# EAGLE design PIN2DMD_Nucleo144 (EAGLE 7.4.0)
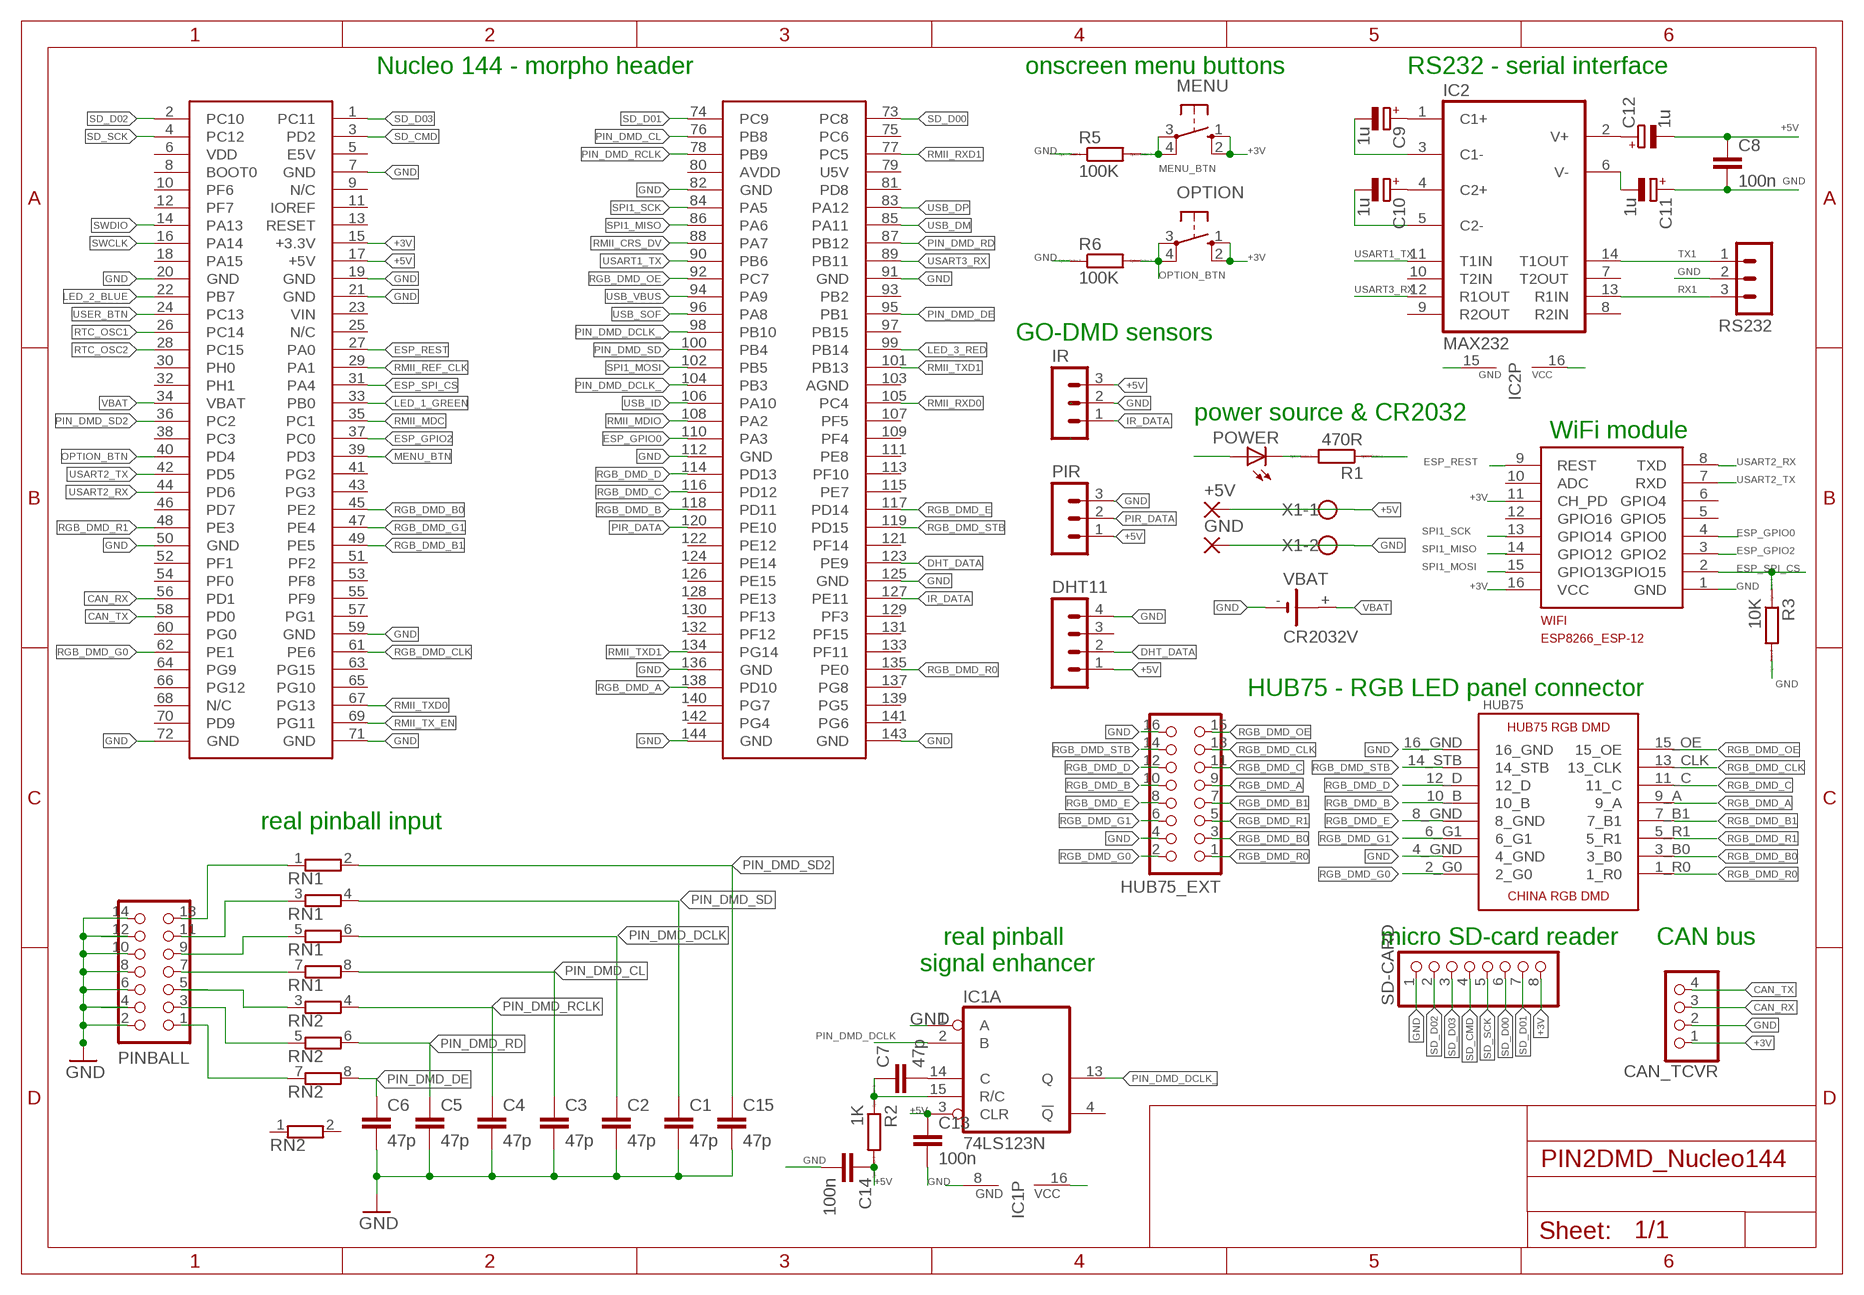
[diagram p0: schematic, sheet 1]

## Parts
+5V  WIREPADSMD2,54-5,08  [SMD2,54-5,08]
C1  47p  C-EU025-024X044  [C025-024X044]
C2  47p  C-EU025-024X044  [C025-024X044]
C3  47p  C-EU025-024X044  [C025-024X044]
C4  47p  C-EU025-024X044  [C025-024X044]
C5  47p  C-EU025-024X044  [C025-024X044]
C6  47p  C-EU025-024X044  [C025-024X044]
C7  47p  C-EU025-024X044  [C025-024X044]
C8  100n  C-EU025-024X044  [C025-024X044]
C9  1u  CPOL-EUE2-4  [E2-4]
C10  1u  CPOL-EUE2-4  [E2-4]
C11  1u  CPOL-EUE2-4  [E2-4]
C12  1u  CPOL-EUE2-4  [E2-4]
C13  100n  C-EU025-024X044  [C025-024X044]
C14  100n  C-EU025-024X044  [C025-024X044]
C15  47p  C-EU025-024X044  [C025-024X044]
CAN_TCVR  PINHD-1X4  [1X04]
DHT11  MA04-1  [MA04-1]
GND  WIREPADSMD2,54-5,08  [SMD2,54-5,08]
HUB75  RGB_DMD_HUB75_HEADER_FEMALE  [16_PIN_HUB75_RGB_FEMALE_DOWN]
HUB75_EXT  CON_HEADER_2X08B  [PINSHRD_PTH_2X08]
IC1  74LS123N  [DIL16]
IC2  MAX232  [DIL16]
IR  MA03-1  [MA03-1]
MENU  10-XX  [B3F-10XX]
OPTION  10-XX  [B3F-10XX]
PINBALL  CON_HEADER_2X07-PTH-SHROUDED  [PINSHRD_PTH_2X07]
PIR  MA03-1  [MA03-1]
POWER  LED3MM  [LED3MM]
R1  470R  R0207/10  [0207/10]
R2  1K  R0207/10  [0207/10]
R3  10K  R0207/10  [0207/10]
R5  100K  R0207/10  [0207/10]
R6  100K  R0207/10  [0207/10]
RN1  E4RP  [SIL8]
RN2  E4RP  [SIL8]
RS232  MA03-1  [MA03-1]
SD-CARD  PINHD-1X8  [1X08]
U$1  NUCLEO-144  [NUCLEO-144]
VBAT  CR2032V  [CR2032V]
WIFI  ESP8266_ESP-12  [ESP8266-ESP12]
X1  W237-102  [W237-102]

## Nets
+3V: CAN_TCVR.1 MENU.1(S) MENU.2(S1) OPTION.1(S) OPTION.2(S1) SD-CARD.8 U$1.15(+3.3V) WIFI.11(CH_PD) WIFI.16(VCC)
+5V: +5V.1(P) C8.1 C12.- C13.1 C14.1 DHT11.1 IC1.3(A:CLR) IC1.16(P:VCC) IC2.16(VCC) IR.3 PIR.1 POWER.A R2.2 U$1.17(+5V) X1.1
CAN_RX: CAN_TCVR.3 U$1.56(PD1)
CAN_TX: CAN_TCVR.4 U$1.58(PD0)
DHT_DATA: DHT11.2 U$1.123(PE9)
ESP_GPIO0: U$1.110(PA3) WIFI.4(GPIO0)
ESP_GPIO2: U$1.37(PC0) WIFI.3(GPIO2)
ESP_REST: U$1.27(PA0) WIFI.9(REST)
ESP_SPI_CS: R3.1 U$1.31(PA4) WIFI.2(GPIO15)
GND: C1.2 C2.2 C3.2 C4.2 C5.2 C6.2 C8.2 C11.+ C13.2 C14.2 C15.2 CAN_TCVR.2 DHT11.4 GND.1(P) HUB75.4_GND HUB75.16_GND HUB75_EXT.4 HUB75_EXT.16 IC1.1(A:A) IC1.8(P:GND) IC2.15(GND) IR.2 PINBALL.2 PINBALL.4 PINBALL.6 PINBALL.8 PINBALL.10 PINBALL.12 PINBALL.14 PIR.3 R1.1 R3.2 R5.1 R6.1 RS232.2 SD-CARD.1 U$1.7(GND) U$1.19(GND) U$1.20(GND) U$1.21(GND) U$1.50(GND) U$1.59(GND) U$1.71(GND) U$1.72(GND) U$1.82(GND) U$1.91(GND) U$1.112(GND) U$1.125(GND) U$1.136(GND) U$1.143(GND) U$1.144(GND) VBAT.- WIFI.1(GND) X1.2
IR_DATA: IR.1 U$1.127(PE11)
LED_1_GREEN: U$1.33(PB0)
LED_2_BLUE: U$1.22(PB7)
LED_3_RED: U$1.99(PB14)
MENU_BTN: MENU.3(P) MENU.4(P1) R5.2 U$1.39(PD3)
N$1: POWER.K(C) R1.2
N$2: C7.1 IC1.15(A:R/C) R2.1
N$3: C7.2 IC1.14(A:C)
N$4: C9.+ IC2.1(C1+)
N$5: PINBALL.7 RN1.7
N$6: PINBALL.5 RN2.3
N$7: C10.+ IC2.4(C2+)
N$8: C11.- IC2.6(V-)
N$9: C9.- IC2.3(C1-)
N$10: C10.- IC2.5(C2-)
N$11: PINBALL.3 RN2.5
N$12: PINBALL.1 RN2.7
N$13: PINBALL.9 RN1.5
N$14: PINBALL.11 RN1.3
N$16: C12.+ IC2.2(V+)
N$18: PINBALL.13 RN1.1
OPTION_BTN: OPTION.3(P) OPTION.4(P1) R6.2 U$1.40(PD4)
PIN_DMD_CL: C3.1 RN1.8 U$1.76(PB8)
PIN_DMD_DCLK: C2.1 IC1.2(A:B) RN1.6
PIN_DMD_DCLK_: IC1.13(A:Q) U$1.98(PB10) U$1.104(PB3)
PIN_DMD_DE: C6.1 RN2.8 U$1.95(PB1)
PIN_DMD_RCLK: C4.1 RN2.4 U$1.78(PB9)
PIN_DMD_RD: C5.1 RN2.6 U$1.87(PB12)
PIN_DMD_SD: C1.1 RN1.4 U$1.100(PB4)
PIN_DMD_SD2: C15.1 RN1.2 U$1.36(PC2)
PIR_DATA: PIR.2 U$1.120(PE10)
RGB_DMD_A: HUB75.9_A HUB75_EXT.9 U$1.138(PD10)
RGB_DMD_B: HUB75.10_B HUB75_EXT.10 U$1.118(PD11)
RGB_DMD_B0: HUB75.3_B0 HUB75_EXT.3 U$1.45(PE2)
RGB_DMD_B1: HUB75.7_B1 HUB75_EXT.7 U$1.49(PE5)
RGB_DMD_C: HUB75.11_C HUB75_EXT.11 U$1.116(PD12)
RGB_DMD_CLK: HUB75.13_CLK HUB75_EXT.13 U$1.61(PE6)
RGB_DMD_D: HUB75.12_D HUB75_EXT.12 U$1.114(PD13)
RGB_DMD_E: HUB75.8_GND HUB75_EXT.8 U$1.117(PD14)
RGB_DMD_G0: HUB75.2_G0 HUB75_EXT.2 U$1.62(PE1)
RGB_DMD_G1: HUB75.6_G1 HUB75_EXT.6 U$1.47(PE4)
RGB_DMD_OE: HUB75.15_OE HUB75_EXT.15 U$1.92(PC7)
RGB_DMD_R0: HUB75.1_R0 HUB75_EXT.1 U$1.135(PE0)
RGB_DMD_R1: HUB75.5_R1 HUB75_EXT.5 U$1.48(PE3)
RGB_DMD_STB: HUB75.14_STB HUB75_EXT.14 U$1.119(PD15)
RMII_CRS_DV: U$1.88(PA7)
RMII_MDC: U$1.35(PC1)
RMII_MDIO: U$1.108(PA2)
RMII_REF_CLK: U$1.29(PA1)
RMII_RXD0: U$1.105(PC4)
RMII_RXD1: U$1.77(PC5)
RMII_TX_EN: U$1.69(PG11)
RMII_TXD0: U$1.67(PG13)
RMII_TXD1: U$1.101(PB13) U$1.134(PG14)
RTC_OSC1: U$1.26(PC14)
RTC_OSC2: U$1.28(PC15)
RX1: IC2.13(R1IN) RS232.3
SD_CMD: SD-CARD.4 U$1.3(PD2)
SD_D00: SD-CARD.6 U$1.73(PC8)
SD_D01: SD-CARD.7 U$1.74(PC9)
SD_D02: SD-CARD.2 U$1.2(PC10)
SD_D03: SD-CARD.3 U$1.1(PC11)
SD_SCK: SD-CARD.5 U$1.4(PC12)
SPI1_MISO: U$1.86(PA6) WIFI.14(GPIO12)
SPI1_MOSI: U$1.102(PB5) WIFI.15(GPIO13)
SPI1_SCK: U$1.84(PA5) WIFI.13(GPIO14)
SWCLK: U$1.16(PA14)
SWDIO: U$1.14(PA13)
TX1: IC2.14(T1OUT) RS232.1
USART1_TX: IC2.11(T1IN) U$1.90(PB6)
USART2_RX: U$1.44(PD6) WIFI.8(TXD)
USART2_TX: U$1.42(PD5) WIFI.7(RXD)
USART3_RX: IC2.12(R1OUT) U$1.89(PB11)
USB_DM: U$1.85(PA11)
USB_DP: U$1.83(PA12)
USB_ID: U$1.106(PA10)
USB_SOF: U$1.96(PA8)
USB_VBUS: U$1.94(PA9)
USER_BTN: U$1.24(PC13)
VBAT: U$1.34(VBAT) VBAT.+
Unconnected: DHT11.3 IC1.4(A:!Q) IC1.5(B:Q) IC1.6(B:C) IC1.7(B:R/C) IC1.9(B:A) IC1.10(B:B) IC1.11(B:CLR) IC1.12(B:!Q) IC2.7(T2OUT) IC2.8(R2IN) IC2.9(R2OUT) IC2.10(T2IN) RN2.1 RN2.2 U$1.5(E5V) U$1.6(VDD) U$1.8(BOOT0) U$1.9(N/C) U$1.10(PF6) U$1.11(IOREF) U$1.12(PF7) U$1.13(RESET) U$1.18(PA15) U$1.23(VIN) U$1.25(N/C) U$1.30(PH0) U$1.32(PH1) U$1.38(PC3) U$1.41(PG2) U$1.43(PG3) U$1.46(PD7) U$1.51(PF2) U$1.52(PF1) U$1.53(PF8) U$1.54(PF0) U$1.55(PF9) U$1.57(PG1) U$1.60(PG0) U$1.63(PG15) U$1.64(PG9) U$1.65(PG10) U$1.66(PG12) U$1.68(N/C) U$1.70(PD9) U$1.75(PC6) U$1.79(U5V) U$1.80(AVDD) U$1.81(PD8) U$1.93(PB2) U$1.97(PB15) U$1.103(AGND) U$1.107(PF5) U$1.109(PF4) U$1.111(PE8) U$1.113(PF10) U$1.115(PE7) U$1.121(PF14) U$1.122(PE12) U$1.124(PE14) U$1.126(PE15) U$1.128(PE13) U$1.129(PF3) U$1.130(PF13) U$1.131(PF15) U$1.132(PF12) U$1.133(PF11) U$1.137(PG8) U$1.139(PG5) U$1.140(PG7) U$1.141(PG6) U$1.142(PG4) VBAT.+@1(+) WIFI.5(GPIO5) WIFI.6(GPIO4) WIFI.10(ADC) WIFI.12(GPIO16)

## Notes on the sheet
- Nucleo 144 - morpho header | onscreen menu buttons | RS232 - serial interface
- GO-DMD sensors
- power source & CR2032
- WiFi module
- HUB75 - RGB LED panel connector
- real pinball input
- micro SD-card reader | CAN bus
- real pinball 
  signal enhancer

## Library data of the parts
+5V GND = wirepad:WIREPAD: Wire PAD connect wire on PCB
C1-C8 C13-C15 = resistor:C-EU: CAPACITOR, European symbol
C9-C12 = resistor:CPOL-EU: POLARIZED CAPACITOR, European symbol
CAN_TCVR = pinhead:PINHD-1X4: PIN HEADER
DHT11 = con-lstb:MA04-1: PIN HEADER; OC_FARNELL: unknown; OC_NEWARK: unknown
HUB75 = zzz_Sascha:RGB_DMD_HUB75_HEADER: RGB DMD Header HUB75 Created 21.10.2015 by DIY Sascha Header zum Anschluss eines CHINA RGB DMD mit 16 Pins Port = HUB75!!! Pin: Function: Desciption: 1 R0 Red data (columns 1-16) 2 G0 Green data (columns 1-16) 3 B0 Blue data (columns 1-16) 4 GND Ground 5 R1 Red data (columns 17-32) 6 G1 Green data (columns 17-32) 7 B1 Blue data (columns 17-32) 8 GND Ground 9 A Demux input A0 10 B Demux input A1 11 C Demux input A2 12 D Demux input E1, E3 (32x32 panels only) 13 CLK LED drivers' clock 14 STB LED drivers' latch 15 OE LED drivers' output enable 16 GND Ground ENJOY!
HUB75_EXT = dp_devices.v6:CON_HEADER_2X08
IC1 = 74xx-eu:74*123: Retriggerable monostable MULTIVIBRATOR
IC2 = maxim:MAX232: RS232 TRANSCEIVER; MF: MAXIM; MPN: MAX232ACPE+; OC_FARNELL: 9723773; OC_NEWARK: 68K4544
IR PIR RS232 = con-lstb:MA03-1: PIN HEADER; OC_FARNELL: unknown; OC_NEWARK: unknown
MENU OPTION = switch-omron:10-XX: OMRON SWITCH; MPN: B3F-1000; OC_FARNELL: 176432; OC_NEWARK: 36M3542
PINBALL = dp_devices.v6:CON_HEADER_2X07: 2x07 pin header
POWER = led:LED: LED OSRAM: - CHIPLED LG R971, LG N971, LY N971, LG Q971, LY Q971, LO R971, LY R971 LH N974, LH R974 LS Q976, LO Q976, LY Q976 LO Q996 - Hyper CHIPLED LW Q18S LB Q993, LB Q99A, LB R99A - SideLED LS A670, LO A670, LY A670, LG A670, LP A670 LB A673, LV A673, LT A673, LW A673 LH A674 LY A675 LS A676, LA A676, LO A676, LY A676, LW A676 LS A679, LY A679, LG A679 - Hyper Micro SIDELED® LS Y876, LA Y876, LO Y876, LY Y876 LT Y87S - SmartLED LW L88C, LW L88S LB L89C, LB L89S, LG L890 LS L89K, LO L89K, LY L89K LS L896, LA L896, LO L896, LY L896 - TOPLED LS T670, LO T670, LY T670, LG T670, LP T670 LSG T670, LSP T670, LSY T670, LOP T670, LYG T670 LG T671, LOG T671, LSG T671 LB T673, LV T673, LT T673, LW T673 LH T674 LS T676, LA T676, LO T676, LY T676, LB T676, LH T676, LSB T676, LW T676 LB T67C, LV T67C, LT T67C, LS T67K, LO T67K, LY T67K, LW E67C LS E67B, LA E67B, LO E67B, LY E67B, LB E67C, LV E67C, LT E67C LW T67C LS T679, LY T679, LG T679 LS T770, LO T770, LY T770, LG T770, LP T770 LB T773, LV T773, LT T773, LW T773 LH T774 LS E675, LA E675, LY E675, LS T675 LS T776, LA T776, LO T776, LY T776, LB T776 LHGB T686 LT T68C, LB T68C - Hyper Mini TOPLED® LB M676 - Mini TOPLED Santana® LG M470 LS M47K, LO M47K, LY M47K Source: http://www.osram.convergy.de LUXEON: - LUMILED® LXK2-PW12-R00, LXK2-PW12-S00, LXK2-PW14-U00, LXK2-PW14-V00 LXK2-PM12-R00, LXK2-PM12-S00, LXK2-PM14-U00 LXK2-PE12-Q00, LXK2-PE12-R00, LXK2-PE12-S00, LXK2-PE14-T00, LXK2-PE14-U00 LXK2-PB12-K00, LXK2-PB12-L00, LXK2-PB12-M00, LXK2-PB14-N00, LXK2-PB14-P00, LXK2-PB14-Q00 LXK2-PR12-L00, LXK2-PR12-M00, LXK2-PR14-Q00, LXK2-PR14-R00 LXK2-PD12-Q00, LXK2-PD12-R00, LXK2-PD12-S00 LXK2-PH12-R00, LXK2-PH12-S00 LXK2-PL12-P00, LXK2-PL12-Q00, LXK2-PL12-R00 Source: www.luxeon.com KINGBRIGHT: KA-3528ASYC Source: www.kingbright.com
R1-R3 R5 R6 = eagle-ltspice:R: RESISTOR, European symbol; SPICEMODEL: NONE; SPICEPREFIX: R
RN1 RN2 = resistor-sil:E4RP: SIL RESISTOR; OC_FARNELL: unknown; OC_NEWARK: unknown
SD-CARD = pinhead:PINHD-1X8: PIN HEADER
U$1 = nucleo-144:NUCLEO-144
VBAT = battery:CR2032V: LI BATTERY Varta
WIFI = ESP8266-ESP12:ESP8266_ESP-12
X1 = con-wago-500:W237-102: WAGO SCREW CLAMP; MPN: 237-102; OC_FARNELL: unknown; OC_NEWARK: 70K9898

## Board
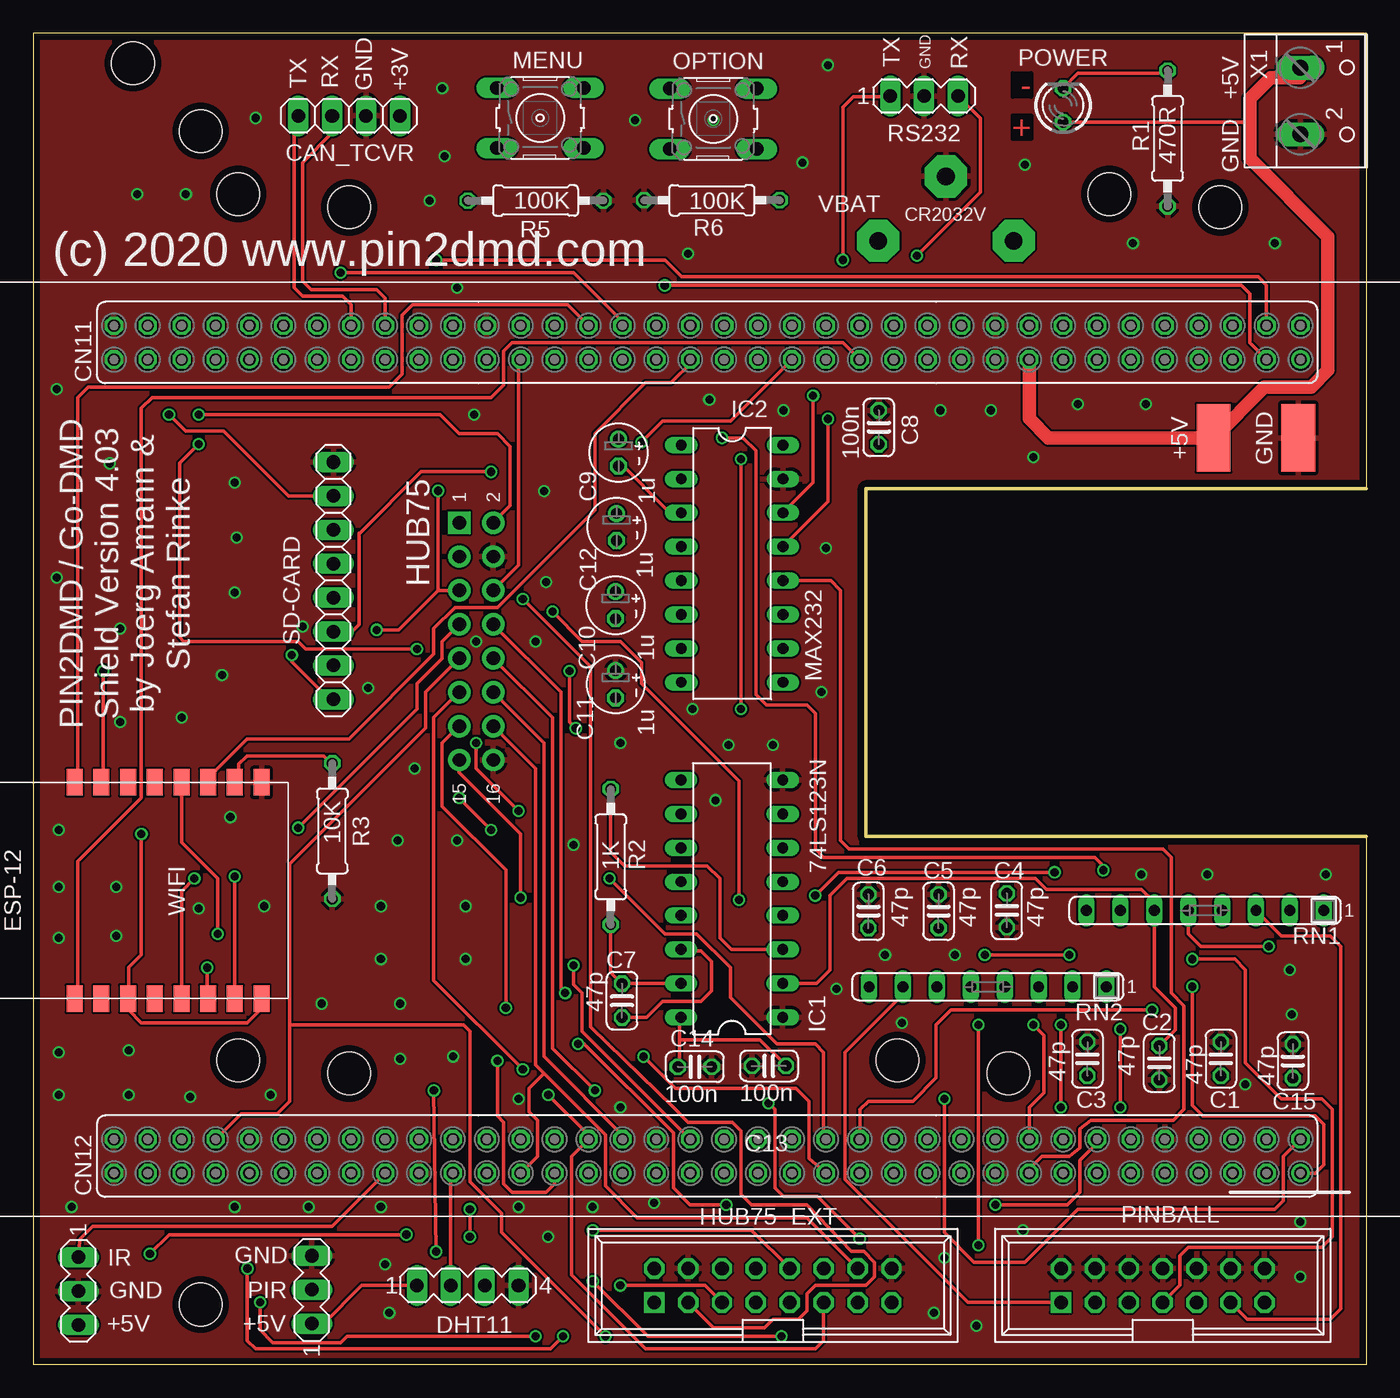
[diagram p1: board, top side]
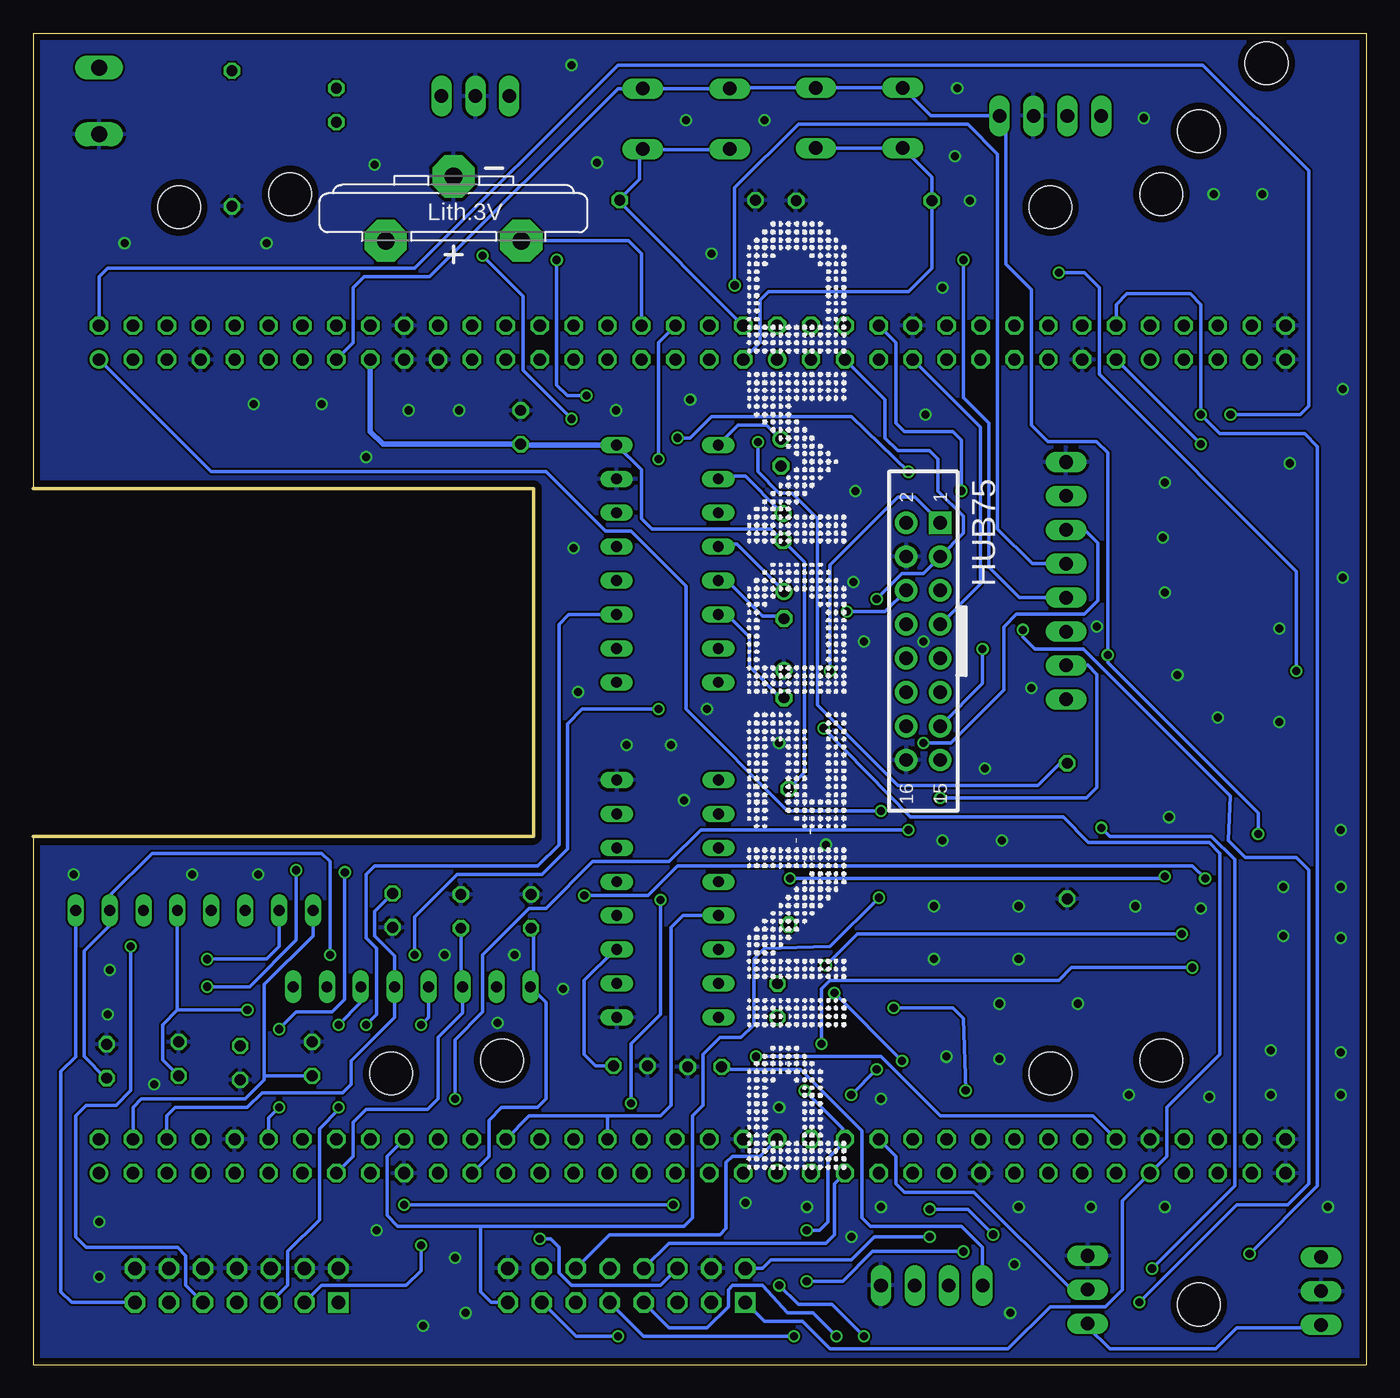
[diagram p2: board, bottom side, seen from below]

Size 99.85 x 99.74 mm. Coordinates in mm from the lower left corner, seen from the top.
Outline: 99.85,99.74 0,99.74 0,0 99.85,0 99.85,39.58 62.39,39.58 62.39,65.62 99.85,65.62 99.85,99.74
Copper layers (1*16): Top 0.035mm / dielectric 1.6mm / Bottom 0.035mm
Design rules "Elecrow_2-layer_PCB_eagle_rule_NAME": minimum track width 6mil, minimum drill 12mil, track to track 6mil, track to pad 6mil, pad to pad 6mil, via to via 8mil, smd to smd 0mil, copper to edge 20mil, drill to drill 10mil, minimum pad ring 6mil, minimum via ring 6mil, stop-mask expansion 0mil, vias tented up to drill 100mil, thermal gap 10mil
Holes 3.2 mm at 23.65,86.7 23.65,21.8 12.54,92.42 12.54,4.5 88.93,86.7 73.06,21.8 7.46,97.5 15.34,87.7 80.61,87.7 64.74,22.8 15.34,22.8

### Footprints (pad centres in the part's own frame; a part is rotated, then mirrored left to right if it is on the bottom)
SMD2,54-5,08 = smd 2.54 x 5.08: 1 0,0
C025-024X044 = drill 0.813 octagon: 1 -1.27,0; 2 1.27,0
E2-4 = drill 0.813 pad 1.27: + -1.016,0 | drill 0.813 pad 1.27 octagon: - 1.016,0
1X04 = drill 1.016 long: 1 -3.81,0; 2 -1.27,0; 3 1.27,0; 4 3.81,0
MA04-1 = drill 1.016 long: 1 -3.81,0; 2 -1.27,0; 3 1.27,0; 4 3.81,0
16_PIN_HUB75_RGB_FEMALE_DOWN = drill 1 pad 1.676 square: 1_R0 17.78,0 | drill 1 pad 1.676: 2_G0 17.78,-2.54; 3_B0 15.24,0; 4_GND 15.24,-2.54; 5_R1 12.7,0; 6_G1 12.7,-2.54; 7_B1 10.16,0; 8_GND 10.16,-2.54; 9_A 7.62,0; 10_B 7.62,-2.54; 11_C 5.08,0; 12_D 5.08,-2.54; 13_CLK 2.54,0; 14_STB 2.54,-2.54; 15_OE 0,0; 16_GND 0,-2.54
PINSHRD_PTH_2X08 = drill 1.016 square: 1 -7.62,-1.27 | drill 1.016 octagon: 2 -7.62,1.27; 3 -5.08,-1.27; 4 -5.08,1.27; 5 -2.54,-1.27; 6 -2.54,1.27; 7 0,-1.27; 8 0,1.27; 9 2.54,-1.27; 10 2.54,1.27; 11 5.08,-1.27; 12 5.08,1.27; 13 7.62,-1.27; 14 7.62,1.27; 15 10.16,-1.27; 16 10.16,1.27
DIL16 = drill 0.813 long: 1 -8.89,-3.81; 2 -6.35,-3.81; 3 -3.81,-3.81; 4 -1.27,-3.81; 5 1.27,-3.81; 6 3.81,-3.81; 7 6.35,-3.81; 8 8.89,-3.81; 9 8.89,3.81; 10 6.35,3.81; 11 3.81,3.81; 12 1.27,3.81; 13 -1.27,3.81; 14 -3.81,3.81; 15 -6.35,3.81; 16 -8.89,3.81
MA03-1 = drill 1.016 long: 1 -2.54,0; 2 0,0; 3 2.54,0
B3F-10XX = drill 1.016 long: 1 -3.251,2.261; 2 3.251,2.261; 3 -3.251,-2.261; 4 3.251,-2.261
PINSHRD_PTH_2X07 = drill 1.016 square: 1 -7.62,-1.27 | drill 1.016 octagon: 2 -7.62,1.27; 3 -5.08,-1.27; 4 -5.08,1.27; 5 -2.54,-1.27; 6 -2.54,1.27; 7 0,-1.27; 8 0,1.27; 9 2.54,-1.27; 10 2.54,1.27; 11 5.08,-1.27; 12 5.08,1.27; 13 7.62,-1.27; 14 7.62,1.27
LED3MM = drill 0.813 octagon: A -1.27,0; K 1.27,0
0207/10 = drill 0.813 octagon: 1 -5.08,0; 2 5.08,0
SIL8 = drill 0.813 long: 1 -8.89,0; 2 -6.35,0; 3 -3.81,0; 4 -1.27,0; 5 1.27,0; 6 3.81,0; 7 6.35,0; 8 8.89,0
1X08 = drill 1.016 long: 1 -8.89,0; 2 -6.35,0; 3 -3.81,0; 4 -1.27,0; 5 1.27,0; 6 3.81,0; 7 6.35,0; 8 8.89,0
NUCLEO-144 = drill 0.914: 1 2.54,88.9; 41 2.54,38.1; 63 2.54,10.16; 73 63.5,88.9; 113 63.5,38.1; 135 63.5,10.16 | drill 0.914 octagon: 2 0,88.9; 3 2.54,86.36; 4 0,86.36; 5 2.54,83.82; 6 0,83.82; 7 2.54,81.28; 8 0,81.28; 9 2.54,78.74; 10 0,78.74; 11 2.54,76.2; 12 0,76.2; 13 2.54,73.66; 14 0,73.66; 15 2.54,71.12; 16 0,71.12; 17 2.54,68.58; 18 0,68.58; 19 2.54,66.04; 20 0,66.04; 21 2.54,63.5; 22 0,63.5; 23 2.54,60.96; 24 0,60.96; 25 2.54,58.42; 26 0,58.42; 27 2.54,55.88; 28 0,55.88; 29 2.54,53.34; 30 0,53.34; 31 2.54,50.8; 32 0,50.8; 33 2.54,48.26; 34 0,48.26; 35 2.54,45.72; 36 0,45.72; 37 2.54,43.18; 38 0,43.18; 39 2.54,40.64; 40 0,40.64; 42 0,38.1; 43 2.54,35.56; 44 0,35.56; 45 2.54,33.02; 46 0,33.02; 47 2.54,30.48; 48 0,30.48; 49 2.54,27.94; 50 0,27.94; 51 2.54,25.4; 52 0,25.4; 53 2.54,22.86; 54 0,22.86; 55 2.54,20.32; 56 0,20.32; 57 2.54,17.78; 58 0,17.78; 59 2.54,15.24; 60 0,15.24; 61 2.54,12.7; 62 0,12.7; 64 0,10.16; 65 2.54,7.62; 66 0,7.62; 67 2.54,5.08; 68 0,5.08; 69 2.54,2.54; 70 0,2.54; 71 2.54,0; 72 0,0; 74 60.96,88.9; 75 63.5,86.36; 76 60.96,86.36; 77 63.5,83.82; 78 60.96,83.82; 79 63.5,81.28; 80 60.96,81.28; 81 63.5,78.74; 82 60.96,78.74; 83 63.5,76.2; 84 60.96,76.2; 85 63.5,73.66; 86 60.96,73.66; 87 63.5,71.12; 88 60.96,71.12; 89 63.5,68.58; 90 60.96,68.58; 91 63.5,66.04; 92 60.96,66.04; 93 63.5,63.5; 94 60.96,63.5; 95 63.5,60.96; 96 60.96,60.96; 97 63.5,58.42; 98 60.96,58.42; 99 63.5,55.88; 100 60.96,55.88; 101 63.5,53.34; 102 60.96,53.34; 103 63.5,50.8; 104 60.96,50.8; 105 63.5,48.26; 106 60.96,48.26; 107 63.5,45.72; 108 60.96,45.72; 109 63.5,43.18; 110 60.96,43.18; 111 63.5,40.64; 112 60.96,40.64; 114 60.96,38.1; 115 63.5,35.56; 116 60.96,35.56; 117 63.5,33.02; 118 60.96,33.02; 119 63.5,30.48; 120 60.96,30.48; 121 63.5,27.94; 122 60.96,27.94; 123 63.5,25.4; 124 60.96,25.4; 125 63.5,22.86; 126 60.96,22.86; 127 63.5,20.32; 128 60.96,20.32; 129 63.5,17.78; 130 60.96,17.78; 131 63.5,15.24; 132 60.96,15.24; 133 63.5,12.7; 134 60.96,12.7; 136 60.96,10.16; 137 63.5,7.62; 138 60.96,7.62; 139 63.5,5.08; 140 60.96,5.08; 141 63.5,2.54; 142 60.96,2.54; 143 63.5,0; 144 60.96,0
CR2032V = drill 1.321 pad 3.15 octagon: + -2.54,-5.08; +@1 -2.54,5.08; - 2.286,0
ESP8266-ESP12 = smd 2 x 1.2: 1 16.2,2; 2 16.2,4; 3 16.2,6; 4 16.2,8; 5 16.2,10; 6 16.2,12; 7 16.2,14; 8 16.2,16; 9 0,16; 10 0,14; 11 0,12; 12 0,10; 13 0,8; 14 0,6; 15 0,4; 16 0,2
W237-102 = drill 1.194 long: 1 -2.5,-1.27; 2 2.5,-1.27

### Placement (x,y rotation side)
+5V  88.42,69.43 0 top
C1  88.97,22.91 90 top
C2  84.36,22.61 270 top
C3  78.97,22.91 90 top
C4  72.93,34.04 270 top
C5  67.83,33.96 90 top
C6  62.56,33.96 90 top
C7  44.1,27.27 270 top
C8  63.34,70.22 90 top
C9  43.84,68.32 270 top
C10  43.62,56.9 270 top
C11  43.63,50.97 270 top
C12  43.69,62.76 270 top
C13  55.11,22.38 180 top
C14  49.56,22.31 0 top
C15  94.36,22.73 90 top
CAN_TCVR  23.65,93.56 180 top
DHT11  32.54,5.93 0 top
GND  94.77,69.43 0 top
HUB75  31.91,45.3 90 top
HUB75_EXT  54.13,5.93 0 top
IC1  52.33,34.91 90 top
IC2  52.36,60.01 270 top
IR  3.37,5.51 270 top
MENU  37.97,93.4 0 top
OPTION  50.94,93.34 0 top
PINBALL  84.61,5.93 0 top
PIR  20.86,5.61 90 top
POWER  77.15,94.35 90 top
R1  84.98,91.86 90 top
R2  43.26,38.04 90 top
R3  22.4,39.98 270 top
R5  37.62,87.21 180 top
R6  50.84,87.24 0 top
RN1  87.79,34.02 180 top
RN2  71.51,28.31 180 top
RS232  66.74,95.05 0 top
SD-CARD  22.48,58.73 270 top
U$1  6.03,77.84 270 top
VBAT  68.37,86.73 90 bottom
WIFI  19.1,27.42 90 top
X1  96.2,94.67 270 top

### Tracks (layer width: path | path; a pad name or v marks a point on that pad's centre or on a via)
+3V  (via drill 0.6)
  Top 0.254: 7.14,27.52 WIFI.11 | WIFI.16 16.99,27.52 16.99,26.57 16.03,25.61 8.1,25.61 7.14,26.57 7.14,27.38 WIFI.11 | v8.1,39.74 8.1,30.69 7.14,29.74 7.14,27.47 WIFI.11 | SD-CARD.8 22.19,49.84 19.37,52.67 v19.37,53.17
  Bottom 0.254: v8.1,39.74 8.1,41.33 19.37,52.6 v19.37,53.17 19.37,53.43 19.37,68.32 20.21,69.16 23.86,69.16 25.08,70.38 25.08,80.54 26.99,82.45 26.99,93.08 CAN_TCVR.1 32.62,93.56 MENU.1 MENU.2 47.62,95.66 OPTION.1 OPTION.2 56.06,95.6 70.17,81.49 75.09,81.49 75.88,80.7 75.88,76.57 U$1.15
+5V
  Top 0.254: DHT11.1 24.61,5.93 21.75,3.07 21.11,3.07 PIR.1 | 48.42,24.34 48.42,25.93 IC1.16 | 48.42,24.34 48.42,22.44 C14.1 | 48.42,24.34 54.45,24.34 56.36,22.44 C13.1 | R2.2 43.26,38.39 44.29,37.36 50.48,37.36 51.43,36.41 51.43,31.96 52.3,31.1 IC1.3 | POWER.A 90.96,93.08 91.12,92.92
  Top 1.016: X1.1 94.89,96.42 92.71,96.42 91.12,94.83 91.12,92.92 91.12,90.38 97,84.51 97,74.51 95.73,73.24 92.23,73.24 +5V.1 76.04,69.43 74.61,70.86 U$1.17
  Bottom 0.254: IR.3 3.65,2.75 9.68,2.75 11.27,1.17 19.21,1.17 20.8,2.75 PIR.1 | IC1.3 56.36,31.01 58.58,28.79 58.58,23.23 57.73,22.38 C13.1 | R2.2 43.02,43.39 42.07,44.35 42.07,60.12 C12.- 43.75,61.75 44.61,62.6 53.5,62.6 54.29,63.4 54.29,67.05 56.15,68.9 IC2.16 | C14.1 48.1,22.12 42.39,22.12 37.78,17.52 37.78,11.01 37.15,10.37 30.32,10.37 28.73,8.79 DHT11.1
  Bottom 0.406: IC2.16 63.13,68.9 C8.1 73.66,68.95 74.61,69.91 U$1.17
CAN_RX
  Top 0.254: CAN_TCVR.3 22.38,92.29 20.16,90.07 20.16,81.18 20.8,80.54 25.72,80.54 26.35,79.91 U$1.56
CAN_TX
  Top 0.254: CAN_TCVR.4 19.53,93.24 19.53,80.7 20.16,80.07 23.18,80.07 23.81,79.43 U$1.58
DHT_DATA
  Top 0.254: DHT11.2 31.27,14.18 U$1.123
ESP_GPIO0  (via drill 0.6, 0.61)
  Top 0.254: v40.48,29.9 40.48,28.47 41.12,27.84 41.12,24.98 U$1.110 | WIFI.4 11.1,39.12 13.81,36.41 v13.81,32.28
  Bottom 0.254: v40.48,29.9 38.1,32.28 v13.81,32.28
ESP_GPIO2
  Top 0.254: WIFI.3 13.18,43.71 13.18,44.03 16.03,46.89 23.65,46.89 30,53.24 30,55.14 31.59,56.73 34.77,56.73 42.07,64.03 42.07,69.75 45.88,73.56 47.78,73.56 49.37,75.14 U$1.37
ESP_REST
  Top 0.254: WIFI.9 3.33,27.52 3.33,37.68 8.1,42.44 8.1,71.65 8.89,72.45 34.29,72.45 35.24,73.4 35.24,75.94 35.88,76.57 60.64,76.57 U$1.27
ESP_SPI_CS  (via drill 0.61)
  Top 0.254: WIFI.2 15.4,43.71 15.4,44.98 16.03,45.62 21.75,45.62 22.38,44.98 R3.1 | U$1.31 52.23,70.7 47.15,70.7 v45.56,69.11
  Bottom 0.254: v45.56,69.11 45.56,66.89 43.97,65.3 43.02,65.3 41.12,63.4 41.12,49.43 35.08,43.39 24.61,43.39 22.7,45.3 R3.1
GND  (via drill 0.6)
  other vias: 31.43,23.07 27.46,22.92 43.97,19.26 1.91,20.22 38.58,9.58 52.07,46.41 51.12,42.28 32.38,34.35 7.14,23.55 27.3,39.27 55.4,46.41 36.35,19.9 26.67,3.87 36.35,11.8 31.75,39.27 6.19,35.77 15.08,57.84 6.51,55.14 37.62,54.19 40.48,38.95 38.26,65.46 33.02,71.18 50.64,72.29 71.76,71.49 59.53,97.37 93.03,84.03 49.05,83.24 74.93,68 57.63,90.07 60.17,28.15 83.03,36.73 82.39,84.03 78.26,71.97 43.97,46.57 49.37,49.11 38.42,58.63 33.18,54.19 27.46,27.04 90.81,21.01 94.14,29.58 96.84,36.73 94.3,26.25 87.95,36.73 69.06,30.69 65.09,25.61 63.82,30.69 74.14,10.06 68.26,7.99 67.47,3.87 1.75,58.95 7.14,20.22 11.75,20.06 17.78,20.22 7.78,87.69 32.38,30.38 26.04,34.35 21.59,27.04 28.57,44.66 25.08,50.7 50.96,93.24 30.8,90.54 1.91,40.06 5.71,67.52 1.75,73.08 2.86,11.8 26.04,11.8 26.04,30.38 46.51,12.12 41.91,11.8 70.64,2.91 6.51,48.16 94.93,6.56 94.93,10.69 67.95,71.49 83.34,71.97 20.64,11.8 15.08,11.8 26.35,7.52 15.24,61.97 15.08,66.1 14.13,51.65 11.11,48.47 11.43,87.69 31.75,80.7 56.2,71.49 59.05,50.38 14.76,41.01 6.19,32.12 12.38,34.19 1.91,31.96 1.91,35.77 17.3,34.35 1.91,23.39 29.69,87.21 30.64,95.62 16.67,93.4 45.09,93.24 74.3,89.91 59.37,61.17 20.16,55.3
  pour Bottom: -0.64,100.39 100.81,100.39 100.81,-0.58 -0.64,-0.58
  pour Top: -0.64,-0.58 100.81,-0.58 100.81,100.39 -0.64,100.39
IR_DATA
  Top 0.254: U$1.127 22.38,10.37 4.44,10.37 3.49,9.42 3.33,8.08 IR.1
MENU_BTN
  Bottom 0.254: MENU.4 MENU.3 32.54,88.96 R5.2 32.54,82.13 34.29,80.38 44.77,80.38 45.4,79.75 45.4,76.57 U$1.39
N$1
  Top 0.254: POWER.K 78.26,96.73 84.93,96.73 R1.2
N$2
  Top 0.254: R2.1 43.26,29.38 C7.1 48.51,28.54 IC1.15
N$3
  Top 0.254: C7.2 45.95,26 47.15,27.2 50.01,27.2 50.8,28 50.8,30.22 50.01,31.01 48.61,31.01 IC1.14
N$4
  Bottom 0.254: C9.+ 43.88,69.34 44.93,70.38 47.07,70.38 IC2.1
N$5  (via drill 0.61)
  Top 0.254: PINBALL.7 85.88,5.93 85.88,8.15 86.52,8.79 96.52,8.79 97.31,9.58 97.31,19.11 96.52,19.9 93.5,19.9 90.8,22.6 90.8,29.58 90.01,30.38 v86.84,30.38
  Bottom 0.254: RN1.7 81.44,31.32 82.39,30.38 v86.84,30.38
N$6  (via drill 0.6)
  Top 0.254: v76.99,25.46 v76.99,19.26
  Bottom 0.254: RN2.3 75.32,27.13 v76.99,25.46 | v76.99,19.26 76.99,19.11 78.42,17.68 78.42,10.85 80.8,8.47 80.8,5.93 PINBALL.5
N$7
  Bottom 0.254: C10.+ 43.66,58 47.15,61.49 48.42,61.49 IC2.4
N$8
  Bottom 0.254: C11.- 43.66,50.06 43.97,50.06 46.2,52.28 46.2,54.51 47.78,56.09 48.42,56.09 IC2.6
N$9
  Top 0.254: IC2.3 48.42,64.03 47.47,64.03 43.97,67.52 C9.-
N$10
  Bottom 0.254: C10.- 43.66,56.09 45.24,56.09 47.78,58.63 48.42,58.63 IC2.5
N$11  (via drill 0.6)
  Top 0.254: v70.8,8.95 v70.8,25.46
  Bottom 0.254: PINBALL.3 78.26,5.93 71.91,5.93 70.8,7.04 v70.8,8.95 | RN2.5 70.24,26.02 v70.8,25.46
N$12
  Top 0.254: PINBALL.1 70.01,4.66 60.8,13.87 60.8,23.39 64.93,27.52 64.93,28.15 RN2.7
N$13  (via drill 0.61)
  Top 0.254: v92.55,31.33 87.47,31.33 86.52,32.28 RN1.5
  Bottom 0.254: v92.55,31.33 92.55,20.53 93.66,19.42 95.88,19.42 96.68,18.63 96.68,9.58 95.88,8.79 89.06,8.79 88.42,8.15 88.42,5.93 PINBALL.9
N$14
  Top 0.254: PINBALL.11 90.96,3.39 97.15,3.39 97.95,4.18 97.95,31.33 97.15,32.12 93.5,32.12 92.39,33.23 RN1.3
N$16
  Bottom 0.254: C12.+ 43.97,64.03 46.51,66.57 48.42,66.57 IC2.2
N$18
  Bottom 0.254: RN1.1 96.68,23.07 97.79,21.96 97.79,5.45 97,4.66 PINBALL.13
OPTION_BTN
  Bottom 0.254: OPTION.3 47.78,91.02 54.13,91.02 OPTION.4 54.45,91.02 54.45,88.8 55.72,87.53 R6.2 55.92,87.09 U$1.40
PIN_DMD_CL
  Bottom 0.254: RN1.8 78.9,32.12 82.55,28.47 82.55,21.65 | U$1.76 92.39,19.26 91.76,19.9 83.98,19.9 82.55,21.33 82.55,21.65 | C3.1 82.54,21.64 82.55,21.65
PIN_DMD_DCLK
  Top 0.254: IC1.2 58.67,28.56 59.69,29.58 59.69,35.14 60.96,36.41 75.09,36.41 75.88,35.62 83.03,35.62 83.98,34.66 RN1.6 83.98,28.31 85.57,26.73 85.57,25.08 C2.1
PIN_DMD_DCLK_
  Bottom 0.254: IC1.13 51.19,33.64 52.07,32.76 52.07,19.42 52.86,18.63 56.83,18.63 | U$1.98 62.71,18.63 56.83,18.63 | 56.83,18.63 U$1.104
PIN_DMD_DE
  Bottom 0.254: C6.1 62.39,32.6 62.39,28.47 RN2.8 61.44,27.13 61.44,19.9 62.07,19.26 64.77,19.26 65.72,18.31 65.72,15.61 U$1.95
PIN_DMD_RCLK
  Bottom 0.254: C4.1 74.29,33.94 74.29,32.12 72.78,30.61 RN2.4 72.78,26.02 76.04,22.76 76.04,21.01 76.68,20.38 82.71,20.38 83.82,19.26 89.22,19.26 89.85,18.63 U$1.78
PIN_DMD_RD
  Bottom 0.254: U$1.87 75.88,15.61 75.88,18.15 74.93,19.11 70.33,19.11 69.53,19.9 69.53,24.5 67.7,26.34 RN2.6 67.83,28.44 C5.1
PIN_DMD_SD  (via drill 0.61)
  Top 0.254: v83.82,26.57 68.74,26.57 67.63,25.46 67.63,21.49 65.88,19.74 62.55,19.74 61.91,19.11 U$1.100
  Bottom 0.254: RN1.4 89.06,26.56 | 89.06,26.56 90.17,25.46 90.17,22.84 C1.1 | v83.82,26.57 89.06,26.57 89.06,26.56
PIN_DMD_SD2  (via drill 0.61)
  Top 0.254: v53.02,49.11 v53.02,67.84 | v77.63,30.69 v71.28,30.69
  Bottom 0.254: C15.1 94.46,21.49 96.04,23.07 96.04,31.01 94.14,32.92 94.14,33.87 RN1.2 94.14,34.19 94.14,35.14 90.96,38.31 78.26,38.31 77.63,37.68 v77.63,30.69 | U$1.36 53.02,76.57 v53.02,67.84 | v71.28,30.69 71.28,33.55 68.1,36.73 61.75,36.73 59.85,38.63 59.85,48 58.74,49.11 v53.02,49.11
PIR_DATA
  Bottom 0.254: U$1.120 35.24,15.61 35.24,13.55 34.61,12.91 29.37,12.91 22.06,5.61 PIR.2
RGB_DMD_A  (via drill 0.61)
  Top 0.254: HUB75.9_A 29.37,50.38 29.37,47.68 19.21,37.52 19.21,25.46 | v42.86,2.12 35.08,9.9 35.08,11.33 32.7,13.71 32.7,24.98 32.23,25.46 19.21,25.46 | U$1.138 15.56,18.79 18.26,18.79 19.21,19.74 19.21,25.46
  Bottom 0.254: HUB75_EXT.9 54.13,2.12 v42.86,2.12
RGB_DMD_B  (via drill 0.61)
  Top 0.254: v41.91,10.06 53.82,10.06 HUB75_EXT.10 | HUB75.10_B 38.89,48.47 38.89,23.71 v42.07,20.53
  Bottom 0.254: v42.07,20.53 39.21,17.68 39.21,17.04 U$1.118 39.05,16.72 40.32,15.45 40.32,10.69 40.96,10.06 v41.91,10.06
RGB_DMD_B0  (via drill 0.61)
  Top 0.254: HUB75_EXT.3 50.96,2.75 54.77,2.75 55.4,3.39 57.31,3.39 57.94,4.02 57.94,5.29 58.58,5.93 62.39,5.93 63.02,6.56 63.02,7.68 62.23,8.47 61.28,8.47 57.94,11.96 53.82,11.96 53.02,12.76 53.02,17.52 52.39,18.15 49.05,18.15 47.94,19.26 41.75,25.3 41.75,52.28 v36.67,57.36
  Bottom 0.254: U$1.45 36.04,72.29 36.04,69.43 35.08,68.48 32.7,68.48 32.07,67.84 32.07,65.46 30.16,63.56 30.16,62.29 HUB75.3_B0 33.18,59.27 34.77,59.27 v36.67,57.36
RGB_DMD_B1  (via drill 0.61)
  Top 0.254: v39.69,2.12 38.73,1.17 16.67,1.17 16.03,1.8 v16.03,7.2 | v19.84,40.22 28.73,49.11 28.73,51.01 30.64,52.92 30.64,54.19 HUB75.7_B1
  Bottom 0.254: HUB75_EXT.7 52.23,2.75 49.37,2.75 47.78,4.34 47.78,5.61 47.47,5.93 45.24,5.93 43.34,3.87 41.43,3.87 v39.69,2.12 | v16.03,7.2 9.84,13.39 9.84,37.84 11.59,39.58 19.21,39.58 v19.84,40.22 | U$1.49 28.89,70.22 28.89,58.48 HUB75.7_B1
RGB_DMD_C  (via drill 0.61)
  Top 0.254: HUB75.11_C 30,48.47 30,28.79 v36.67,22.12 | HUB75_EXT.11 59.21,1.8 58.58,1.17 45.88,1.17 40.32,6.72 40.32,15.61 U$1.116 41.59,17.2 v38.58,20.22
  Bottom 0.254: v38.58,20.22 v36.67,22.12
RGB_DMD_CLK  (via drill 0.6, 0.61)
  Top 0.254: v56.04,2.12 46.04,2.12 v41.91,6.25 | v30,20.53 v30.16,8.47 | v35.4,26.73 35.4,37.04 30.64,41.81 30.64,46.57 HUB75.13_CLK | v12.38,68.95 10.95,67.52 10.95,54.51 11.27,54.19 19.84,54.19 20.42,53.62 v28.73,53.62
  Bottom 0.254: HUB75.13_CLK 28.73,51.01 v28.73,53.62 | HUB75_EXT.13 59.21,2.12 v56.04,2.12 | v41.91,6.25 39.21,6.25 36.99,8.47 v30.16,8.47 | v30,20.53 30.16,25.93 30.96,26.73 v35.4,26.73 | v12.38,68.95 U$1.61
RGB_DMD_D
  Top 0.254: HUB75.12_D 38.26,46.57 38.26,23.07 44.29,17.04 U$1.114
  Bottom 0.254: U$1.114 45.4,15.61 47.47,15.61 47.94,15.14 47.94,10.22 48.42,9.74 56.67,9.74 HUB75_EXT.12
RGB_DMD_E  (via drill 0.61)
  Top 0.254: HUB75.8_GND 39.53,50.38 39.53,28.15 v39.85,27.84 | v34.77,22.76 34.77,18.63 35.24,18.15 35.24,13.55 35.88,12.91 38.42,12.91 39.05,13.55 U$1.117
  Bottom 0.254: HUB75_EXT.8 52.23,9.1 40.48,9.1 39.85,9.74 39.85,13.55 U$1.117 | v34.77,22.76 v39.85,27.84
RGB_DMD_G0  (via drill 0.61)
  Top 0.254: v27.94,9.74 10.16,9.74 v8.73,8.31 | v32.7,11.64 v32.7,9.58 | HUB75.2_G0 35.72,64.35 35.72,68.79 34.77,69.75 31.91,69.75 30.48,71.18 v12.38,71.18
  Bottom 0.254: v32.7,9.58 36.83,9.58 38.58,7.83 44.61,7.83 45.24,7.2 HUB75_EXT.2 | v27.94,9.74 29.84,11.64 v32.7,11.64 | v8.73,8.31 3.65,13.39 3.65,68.79 4.6,69.75 10.95,69.75 v12.38,71.18 12.38,79.43 13.18,80.22 17.94,80.22 18.73,79.43 U$1.62
RGB_DMD_G1  (via drill 0.61)
  Top 0.254: HUB75.6_G1 36.35,59.9 36.35,75.14 U$1.47 | v52.86,34.82 52.86,43.71 45.56,51.01 45.56,52.6 43.97,54.19 41.12,54.19 v38.89,56.41 | v55.09,19.58 55.56,19.11 55.56,13.23 56.2,12.6 58.74,12.6 v61.91,9.42
  Bottom 0.254: HUB75_EXT.6 52.86,5.93 59.53,5.93 60.48,6.88 60.48,8.79 61.12,9.42 v61.91,9.42 | v55.09,19.58 55.09,24.03 52.86,26.25 v52.86,34.82 | v38.89,56.41 36.04,56.41 HUB75.6_G1
RGB_DMD_OE  (via drill 0.61)
  Top 0.254: HUB75.15_OE 31.91,44.35 36.51,39.74 v36.51,34.98
  Bottom 0.254: v36.51,34.98 40.16,31.33 45.08,31.17 45.88,30.38 45.88,25.46 46.83,24.5 48.42,24.5 49.69,23.23 49.69,19.42 50.48,18.63 50.48,11.01 51.12,10.37 66.36,10.37 | 66.36,10.37 72.55,10.37 73.34,11.17 73.34,15.61 U$1.92 | HUB75_EXT.15 65.56,4.66 66.36,5.45 66.36,10.37
RGB_DMD_R0  (via drill 0.61)
  Top 0.254: v40.16,51.97 40.16,48.16 v40.64,47.68
  Bottom 0.254: HUB75.1_R0 33.81,64.98 35.08,64.98 40.16,59.9 v40.16,51.97 | HUB75_EXT.1 45.08,3.23 42.23,3.23 40.16,1.17 26.83,1.17 23.65,4.34 19.53,4.34 18.26,5.61 18.26,12.28 U$1.135 14.92,15.61 14.92,19.26 10.95,23.23 10.95,38.31 11.75,39.11 20.8,39.11 22.7,41.01 34.13,41.01 v40.64,47.68
RGB_DMD_R1  (via drill 0.61)
  Top 0.254: 30.32,58 v30.32,65.46 | HUB75_EXT.5 50.32,5.93 v43.97,5.93 | v37.62,2.12 23.49,2.12 23.02,1.64 17.94,1.64 16.99,2.6 v16.99,4.66 16.99,4.34 | HUB75.5_R1 30.32,58 | v25.72,55.05 27.37,55.05 30.32,58
  Bottom 0.254: v16.99,4.66 9.68,11.96 5.87,11.96 4.29,13.55 4.29,37.04 5.24,38 9.05,38 10.32,39.27 10.16,42.6 21.18,53.62 24.83,53.62 25.72,54.51 v25.72,55.05 | v43.97,5.93 42.54,4.5 40,4.5 v37.62,2.12 | U$1.48 35.24,76.57 35.24,70.54 34.61,69.91 30.96,69.91 30.32,69.27 v30.32,65.46
RGB_DMD_STB
  Top 0.254: HUB75.14_STB 37.62,44.66 37.62,22.44 38.26,21.8 | HUB75_EXT.14 57.94,11.01 45.24,11.01 42.86,13.39 42.86,17.2 38.26,21.8 | U$1.119 37.78,15.61 37.78,18.31 37.15,18.95 37.15,20.69 38.26,21.8
RMII_TXD1  (via drill 0.61)
  Top 0.254: U$1.101 59.21,14.5 58.1,15.45 58.1,19.74 57.15,20.69 48.1,20.69 v45.72,23.07
  Bottom 0.254: U$1.134 20.48,18.63 31.91,18.63 36.35,23.07 v45.72,23.07
RX1  (via drill 0.61)
  Top 0.254: v59.53,70.86 59.53,64.67 56.36,61.49 IC2.13 | v66.2,83.08 70.96,87.84 70.96,93.36 RS232.3
  Bottom 0.254: v59.53,70.86 63.18,74.51 63.18,80.07 v66.2,83.08
SD_CMD  (via drill 0.61)
  Top 0.254: v47.31,80.86 90.49,80.86 91.12,80.22 91.12,76.57 U$1.3
  Bottom 0.254: v47.31,80.86 47.31,88.16 42.54,92.92 29.84,92.92 27.62,90.7 27.62,62.6 25.02,60 SD-CARD.4
SD_D00  (via drill 0.61)
  Top 0.254: v86.84,28.31 86.84,19.42 87.63,18.63 96.04,18.63 96.68,17.99 96.68,14.98 96.04,14.34 U$1.73 | v34.29,66.89 29.05,66.89 24.48,62.32 24.42,62.32 24.42,55.46 23.91,54.95 22.51,54.95 SD-CARD.6 | v80.17,37.04 80.17,37.36 79.53,38 59.21,38 58.58,38.63 58.58,48.79 57.94,49.43 54.93,49.43 54.13,50.22 54.13,68.48 53.18,69.43 v51.59,69.43
  Bottom 0.254: v51.59,69.43 50.64,69.43 49.05,71.02 38.58,71.02 v34.29,66.89 | v80.17,37.04 80.17,31.81 83.66,28.31 v86.84,28.31
SD_D01  (via drill 0.61)
  Top 0.254: U$1.74 93.66,15.61 93.66,12.28 93.03,11.64 78.26,11.64 74.29,7.68 70.48,7.68 68.26,9.9 v68.26,19.9 | v31.91,42.44 v34.29,40.06
  Bottom 0.254: v68.26,19.9 68.26,24.34 66.2,26.41 66.2,30.69 62.71,34.19 61.44,34.19 57.94,37.68 52.23,37.68 49.85,40.06 v34.29,40.06 | v31.91,42.44 20.95,42.44 20.16,43.24 20.16,51.71 20.86,52.41 22.45,52.41 SD-CARD.7
SD_D02  (via drill 0.61)
  Top 0.254: SD-CARD.2 19.11,65.08 14.26,69.94 11.4,69.94 v10.16,71.18
  Bottom 0.254: v10.16,71.18 4.92,71.18 4.29,71.81 4.29,89.43 12.22,97.37 56.04,97.37 71.28,82.13 94.3,82.13 94.93,81.49 U$1.2
SD_D03  (via drill 0.61)
  Top 0.254: v36.35,41.49 33.18,44.66 v33.18,46.57
  Bottom 0.254: U$1.1 86.52,66.89 61.44,66.89 56.99,62.44 55.09,62.44 50.96,58.32 50.96,49.11 43.34,41.49 v36.35,41.49 | v33.18,46.57 31.11,46.57 27.15,50.54 27.15,55.27 26.19,56.22 21.11,56.22 20.1,57.24 20.1,61.56 21.08,62.54 SD-CARD.3
SD_SCK  (via drill 0.61)
  Top 0.254: v30.16,82.76 47.31,82.76 48.58,81.49 91.76,81.49 92.39,80.86 U$1.4
  Bottom 0.254: v30.16,82.76 30.16,72.45 28.26,70.54 28.26,59.75 25.97,57.46 SD-CARD.5
SPI1_MISO  (via drill 0.61)
  Top 0.254: v51.91,11.96 49.21,11.96 47.94,13.23 47.94,17.36 41.27,24.03 v40.8,24.03 | v72.07,11.96 77.47,11.96 78.42,12.91 78.42,15.3 79.69,16.57 U$1.86 | v13.02,29.74 13.02,27.5 WIFI.14
  Bottom 0.254: v40.8,24.03 40.8,28.15 40.16,28.79 23.02,28.79 22.07,29.74 v13.02,29.74 | v72.07,11.96 v51.91,11.96
SPI1_MOSI  (via drill 0.6)
  Top 0.254: 15.08,27.52 WIFI.15 15.08,27.44 v15.08,36.57 | U$1.102 59.21,17.04 59.21,23.39 58.58,24.03 55.72,24.03 52.23,27.52 52.23,29.74 49.69,32.28 47.31,32.28 v43.18,36.41
  Bottom 0.254: v43.18,36.41 15.24,36.41 v15.08,36.57
SPI1_SCK  (via drill 0.6, 0.61)
  Top 0.254: v76.52,36.89 60.32,36.89 v58.58,35.14 | v81.44,19.26 v81.44,25.14 | 10.95,27.36 11.11,27.2 11.27,27.2 WIFI.13 11.11,27.44 11.11,35.46 v12.06,36.41
  Bottom 0.254: v58.58,35.14 53.82,35.14 51.59,37.36 13.02,37.36 v12.06,36.41 | v76.52,36.89 76.52,27.36 77.47,26.41 80.17,26.41 v81.44,25.14 | U$1.84 82.23,18.47 v81.44,19.26
TX1  (via drill 0.61)
  Top 0.254: v60.64,82.76 60.64,94.19 61.44,94.99 64.14,94.99 RS232.1 | v58.42,72.6 58.42,66.08 IC2.14
  Bottom 0.254: v60.64,82.76 60.64,73.4 59.85,72.6 v58.42,72.6
USART1_TX  (via drill 0.6)
  Top 0.254: U$1.90 74.61,19.26 75.72,20.38 75.72,24.66 v74.93,25.46
  Bottom 0.254: v74.93,25.46 74.14,26.25 74.14,31.17 74.93,31.96 74.93,36.73 74.29,37.36 62.07,37.36 60.48,38.95 60.48,55.46 59.74,56.2 IC2.11
USART2_RX
  Top 0.254: WIFI.8 3.33,43.71 3.33,72.45 4.13,73.24 26.67,73.24 27.62,74.19 27.62,78.64 28.42,79.43 40,79.43 U$1.44
USART2_TX  (via drill 0.61)
  Top 0.254: v5.24,51.97 5.24,43.71 WIFI.7 | v23.02,81.81 40.48,81.81 44.29,78 U$1.42
  Bottom 0.254: v23.02,81.81 21.11,81.81 20,80.7 20,74.19 5.24,59.43 v5.24,51.97
USART3_RX
  Top 0.254: U$1.89 74.61,14.66 75.56,15.61 77.63,15.61 78.42,16.25 78.42,17.68 79.22,18.31 85.41,18.31 86.2,19.11 86.2,26.88 85.25,27.84 85.25,38 84.61,38.63 61.12,38.63 60.48,39.27 60.48,58 59.74,58.74 IC2.12
VBAT
  Bottom 0.254: VBAT.+ 55.24,84.19 54.29,83.24 U$1.34

### Text on the board
Top: - | +
tNames: TX | GND | RX | +5V | TX | RX | GND | +3V | GND | (c) 2020 www.pin2dmd.com | PIN2DMD / Go-DMD / Shield Version 4.03 / by Joerg Amann & / Stefan Rinke | GND | GND | +5V | +5V